# Altium schematic sheet Controller_driver.SchDoc: Controller Driver
size Tabloid; DrawnBy: Nicholas Belsten; Organization: MIT AeroAstro; DocumentNumber: 1; Revision: C; SheetNumber: 1; SheetTotal: 1; ProgramName: HelmHoltz Cage
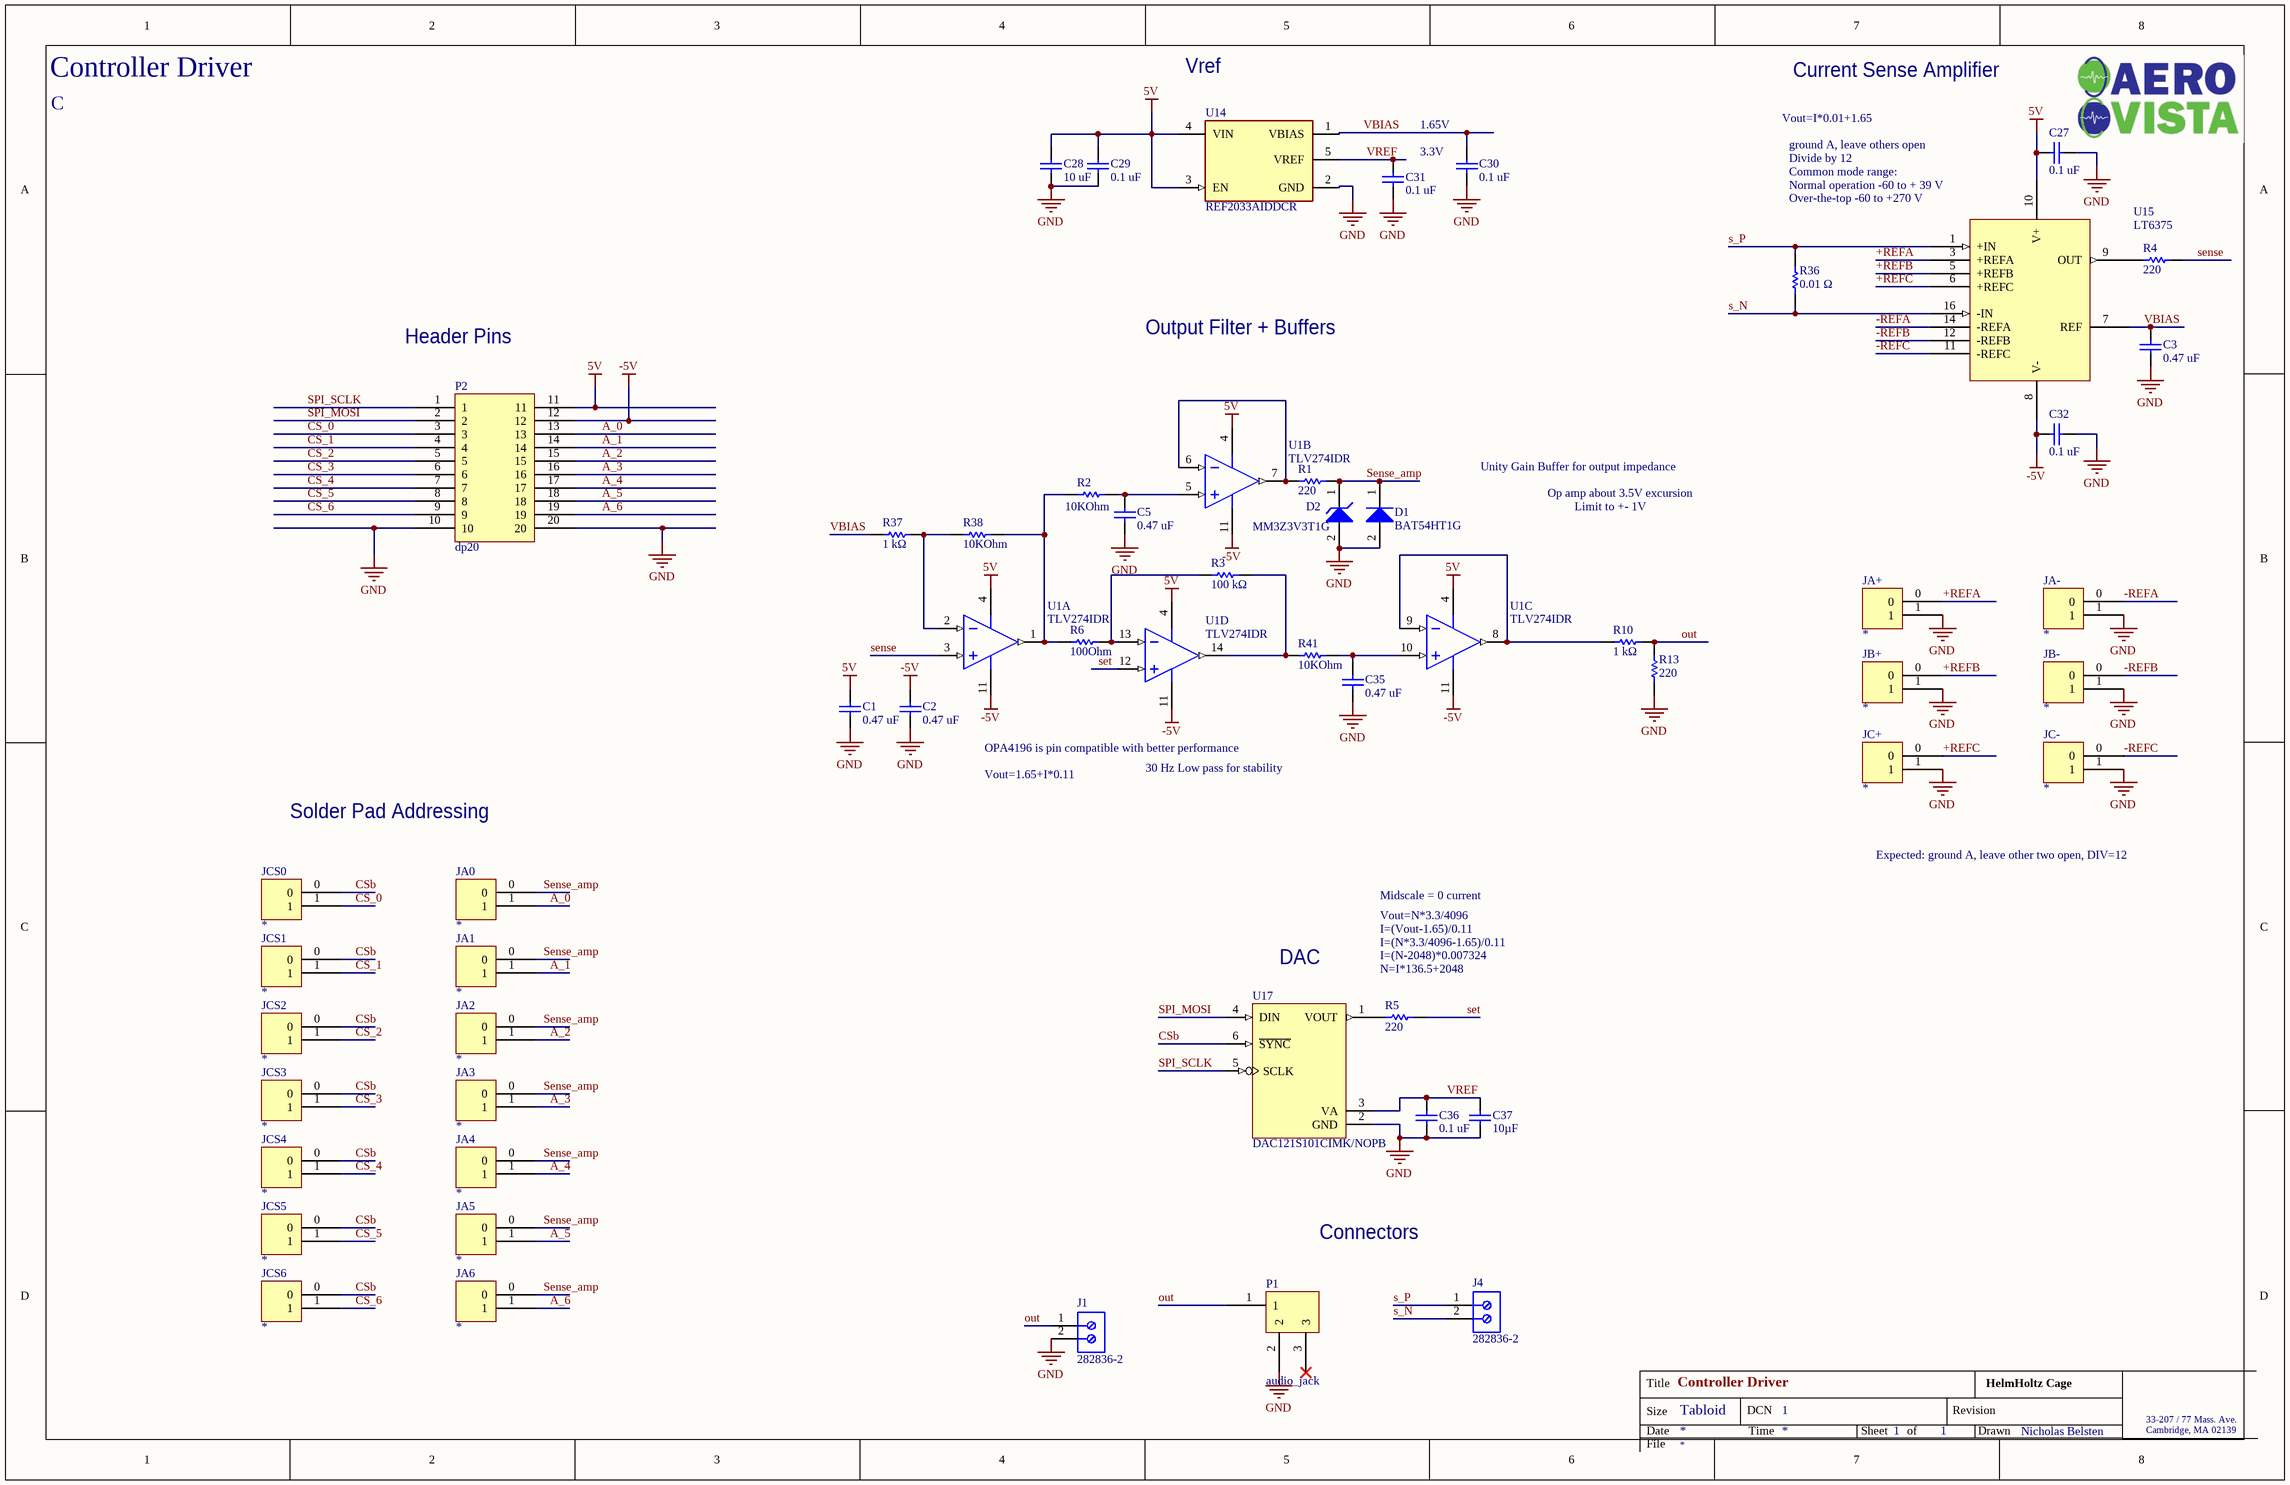
[diagram p0: Controller_driver.SchDoc]

## Parts
C1  0.47 uF  [CAPC1608X90X35ML10T15]
C2  0.47 uF  [CAPC1608X90X35ML10T15]
C3  0.47 uF  [CAPC1608X90X35ML10T15]
C5  0.47 uF  [CAPC1608X90X35ML10T15]
C27  0.1 uF  [CAPC1608X87X35NL15T15]
C28  10 uF  [CAPC1608X90X20ML10]
C29  0.1 uF  [CAPC1608X87X35NL15T15]
C30  0.1 uF  [CAPC1608X87X35NL15T15]
C31  0.1 uF  [CAPC1608X87X35NL15T15]
C32  0.1 uF  [CAPC1608X87X35NL15T15]
C35  0.47 uF  [CAPC1608X90X35ML10T15]
C36  0.1 uF  [CAPC1608X87X35NL15T15]
C37  10µF  [CAPC1608X90X20ML10]
D1  BAT54HT1G  [ONSC-SOD-323-2-477-02_V]
D2  MM3Z3V3T1G  [ONSC-SOD-323-2-477-02_V]
J1  282836-2  [TECO-282836-2_V]
J4  282836-2  [TECO-282836-2_V]
JA0  *  [solder_jumper]
JA1  *  [solder_jumper]
JA2  *  [solder_jumper]
JA3  *  [solder_jumper]
JA4  *  [solder_jumper]
JA5  *  [solder_jumper]
JA6  *  [solder_jumper]
JA+  *  [solder_jumper]
JA-  *  [solder_jumper]
JB+  *  [solder_jumper]
JB-  *  [solder_jumper]
JC+  *  [solder_jumper]
JC-  *  [solder_jumper]
JCS0  *  [solder_jumper]
JCS1  *  [solder_jumper]
JCS2  *  [solder_jumper]
JCS3  *  [solder_jumper]
JCS4  *  [solder_jumper]
JCS5  *  [solder_jumper]
JCS6  *  [solder_jumper]
P1  audio_jack  [MJ-3536NG]
P2  dp20  [dp20-900-double]
R1  220  [RESC1609X50X30LL10T20]
R2  10KOhm  [RESC1609X55X30LL15T15]
R3  100 kΩ  [RESC1608X55X25NL10T15]
R4  220  [RESC1609X50X30LL10T20]
R5  220  [RESC1609X50X30LL10T20]
R6  100Ohm  [RESC1608X55X25NL10T15]
R10  1 kΩ  [RESC1608X55X30LL20T20]
R13  220  [RESC1609X50X30LL10T20]
R36  0.01 Ω  [RESC3216X70X50LL05T20]
R37  1 kΩ  [RESC1608X55X30LL15T15]
R38  10KOhm  [RESC1609X55X30LL15T15]
R41  10KOhm  [RESC1609X55X30LL15T15]
U1  TLV274IDR  [D0014A_N]  (parts A,B,C,D of 4)
U14  REF2033AIDDCR  [FP-DDC0005A-MFG]
U15  LT6375  [SOP16-12]
U17  DAC121S101CIMK/NOPB  [MK06A_N]

## Nets
5V: C1.2 C27.2 C28.2 C29.2 P2.11 U1.4(VDD) U14.3(EN) U14.4(VIN) U15.10(V+)
-5V: C2.2 C32.2 P2.12 U1.11(GND) U15.8(V-)
GND: C1.1 C2.1 C3.1 C5.1 C27.1 C28.1 C29.1 C30.1 C31.1 C32.1 C35.1 C36.1 C37.1 D1.2(A) D2.2(A) J1.2 JA+.1 JA-.1 JB+.1 JB-.1 JC+.1 JC-.1 P1.2 P2.10 P2.20 R13.1 U14.2(GND) U17.2(GND)
+REFA: JA+.0 U15.3(+REFA)
+REFB: JB+.0 U15.5(+REFB)
+REFC: JC+.0 U15.6(+REFC)
-REFA: JA-.0 U15.14(-REFA)
-REFB: JB-.0 U15.12(-REFB)
-REFC: JC-.0 U15.11(-REFC)
A_0: JA0.1 P2.13
A_1: JA1.1 P2.14
A_2: JA2.1 P2.15
A_3: JA3.1 P2.16
A_4: JA4.1 P2.17
A_5: JA5.1 P2.18
A_6: JA6.1 P2.19
CS_0: JCS0.1 P2.3
CS_1: JCS1.1 P2.4
CS_2: JCS2.1 P2.5
CS_3: JCS3.1 P2.6
CS_4: JCS4.1 P2.7
CS_5: JCS5.1 P2.8
CS_6: JCS6.1 P2.9
CSb: JCS0.0 JCS1.0 JCS2.0 JCS3.0 JCS4.0 JCS5.0 JCS6.0 U17.6(~{SYNC})
out: J1.1 P1.1 R10.2 R13.2
s_N: J4.2 R36.1 U15.16(-IN)
s_P: J4.1 R36.2 U15.1(+IN)
sense: R4.2 U1.3(IN1+)
Sense_amp: D1.1(K) D2.1(K) JA0.0 JA1.0 JA2.0 JA3.0 JA4.0 JA5.0 JA6.0 R1.2
set: R5.2 U1.12(IN4+)
SPI_MOSI: P2.2 U17.4(DIN)
SPI_SCLK: P2.1 U17.5(SCLK)
VBIAS: C3.2 C30.2 R37.2 U14.1(VBIAS) U15.7(REF)
VREF: C31.2 C36.2 C37.2 U14.5(VREF) U17.3(VA)
NetC5_2: C5.2 R2.2 U1.5(IN2+)
NetC35_2: C35.2 R41.2 U1.10(IN3+)
NetR1_1: R1.1 U1.6(IN2-) U1.7(OUT2)
NetR2_1: R2.1 R6.1 R38.2 U1.1(OUT1)
NetR3_1: R3.1 R41.1 U1.14(OUT4)
NetR3_2: R3.2 R6.2 U1.13(IN4-)
NetR4_1: R4.1 U15.9(OUT)
NetR5_1: R5.1 U17.1(VOUT)
NetR10_1: R10.1 U1.8(OUT3) U1.9(IN3-)
NetR37_1: R37.1 R38.1 U1.2(IN1-)

Not connected (* = marked no-connect by the designer): P1 3*

## Notes on the sheet
- Vref
- Current Sense Amplifier
- 3.3V
- 1.65V
- Vout=I*0.01+1.65
- ground A, leave others open
- Divide by 12
- (near U15) Normal operation -60 to + 39 V
- (near U15) Over-the-top -60 to +270 V
- Common mode range:
- Header Pins
- Output Filter + Buffers
- Unity Gain Buffer for output impedance
- Op amp about 3.5V excursion
- Limit to +- 1V
- OPA4196 is pin compatible with better performance
- Solder Pad Addressing
- Vout=1.65+I*0.11
- 30 Hz Low pass for stability
- Midscale = 0 current
- Expected: ground A, leave other two open, DIV=12
- (near U17) DAC
- Vout=N*3.3/4096
- I=(Vout-1.65)/0.11
- I=(N*3.3/4096-1.65)/0.11
- I=(N-2048)*0.007324
- N=I*136.5+2048
- Connectors
- Title
- Size
- Date
- Tabloid
- DCN
- Time
- Sheet
- of
- Revision
- Drawn
- 33-207 / 77 Mass. Ave.
- Cambridge, MA 02139
- File

## Library data of the parts
C1-C3 C5 C35 = CMP-2006-02860-1: Manufacturer: Murata; Part Number: GRM188R71C474KA88D
C27 C29-C32 C36 = CMP-2006-03300-1: Part Number: C0603X104K5RACTU; Manufacturer: Kemet; Capacitance: 0.1 uF
C28 = CMP-2000-04979-1: Chip Capacitor, 10 uF, +/- 10%, 10 V, -55 to 85 degC, 0603 (1608 Metric), RoHS, Tape and Reel; PCN Part Number: MLCCPartNumberChange30/Nov/2012; Manufacturer: TDK; Temperature Coefficient: X5R; Product Training Modules: CSeriesGeneralApplicationsSEAT,CCV,andTVCLDesignToolsGuidetoReplacinganElectrolyticCapacitorwithanMLCC; Online Catalog: CSeries,GeneralPurpose; Voltage - Rated: 10V; Other Names: 445-7486-1; Capacitance: 10µF; Design Resources: 20WNon-IsolatedBuckLEDDriverUsingPLLNK460KG; Kits: 445-9003-KIT-ND-KITCAPCERHICAPMLCCSMD; Height - Seated (Max): -; Family: CeramicCapacitors; Package Description: 2-Pin Surface Mount Device, Body 1.6 x 0.8 mm; Category: Capacitors; Datasheet Version: Mar-15; RoHS Information: RoHSCertificate-MLCC; Thickness (Max): 0.035"(0.90mm); Operating Temperature: -55degC~85degC; Package Reference: 603; Series: C; Applications: GeneralPurpose; Datasheet URL: http://download.siliconexpert.com/pdfs/2015/4/21/15/54/45/779/tdk_/manual/37024850441143360mlcc_commercial_general_en.pdf; Features: -; Lead Style: -; Lead Spacing: -; Ratings: -; Size / Dimension: 0.063"Lx0.031"W(1.60mmx0.80mm); Tolerance: ±10%; Mounting Type: SurfaceMount,MLCC; Standard Package: 1; Package / Case: 0603(1608Metric); Manufacturer URL: http://www.tdk.com/; Packaging: CutTape(CT)
C37 = CMP-2000-04979-1: Chip Capacitor, 10 uF, +/- 10%, 10 V, -55 to 85 degC, 0603 (1608 Metric), RoHS, Tape and Reel; PCN Part Number: MLCCPartNumberChange30/Nov/2012; Manufacturer: TDK; Temperature Coefficient: X5R; Product Training Modules: CSeriesGeneralApplicationsSEAT,CCV,andTVCLDesignToolsGuidetoReplacinganElectrolyticCapacitorwithanMLCC; Online Catalog: CSeries,GeneralPurpose; Voltage - Rated: 10V; Other Names: 445-7486-1; Design Resources: 20WNon-IsolatedBuckLEDDriverUsingPLLNK460KG; Kits: 445-9003-KIT-ND-KITCAPCERHICAPMLCCSMD; Height - Seated (Max): -; Family: CeramicCapacitors; Package Description: 2-Pin Surface Mount Device, Body 1.6 x 0.8 mm; Category: Capacitors; Datasheet Version: Mar-15; RoHS Information: RoHSCertificate-MLCC; Thickness (Max): 0.035"(0.90mm); Operating Temperature: -55degC~85degC; Package Reference: 603; Series: C; Applications: GeneralPurpose; Datasheet URL: http://download.siliconexpert.com/pdfs/2015/4/21/15/54/45/779/tdk_/manual/37024850441143360mlcc_commercial_general_en.pdf; Capacitance: 10µF; Features: -; Lead Style: -; Lead Spacing: -; Ratings: -; Size / Dimension: 0.063"Lx0.031"W(1.60mmx0.80mm); Tolerance: ±10%; Mounting Type: SurfaceMount,MLCC; Standard Package: 1; Package / Case: 0603(1608Metric); Manufacturer URL: http://www.tdk.com/; Packaging: CutTape(CT)
D1 = CMP-1055-00462-1: Schottky Barrier Diode, 2-Pin SOD-323, Pb-Free, Tape and Reel; Manufacturer: On Semiconductor; Configuration: Single; trr Max (ns): 5; IFSM Max (A): 0.6; ComponentLink3URL: http://www.onsemi.com/pub_link/Collateral/477-02.PDF.1; PackageDescription: 2-Pin SOD, Body 1.7 x 1.25 mm; ComponentLink2URL: http://www.onsemi.cn/pub_link/Collateral/BAT54HT1-D.PDF; ComponentLink3Description: Package Specification; ComponentLink2Description: Datasheet; DatasheetVersion: Rev. 6; PackageReference: SOD-323-2-477-02; RoHS: TRUE; ComponentLink1URL: http://www.onsemi.com/; Packing: Tape and Reel; PartNumber: BAT54HT1G; Mounting Technology: Surface Mount; ComponentLink1Description: Manufacturer URL; PackageVersion: Rev. H, 03/2007
D2 = CMP-1060-00672-1: Zener Voltage Regulator, 300 mW, 2-Pin SOD-323, Pb-Free, Tape and Reel; Manufacturer: On Semiconductor; VZ Typ (V): 3.3; P Max (W): 0.3; ComponentLink1URL: http://www.onsemi.com/; ComponentLink2Description: Datasheet; PackageVersion: Rev. H, 03/2007; PartNumber: MM3Z3V3T1G; PackageReference: SOD-323-2-477-02; ComponentLink1Description: Manufacturer URL; PackageDescription: 2-Pin SOD, Body 1.7 x 1.25 mm; RoHS: Pb-Free; ComponentLink3Description: Package Specification; Packing: Tape and Reel; DatasheetVersion: Rev. 9; ComponentLink3URL: http://www.onsemi.com/pub_link/Collateral/477-02.PDF.1; Mounting Technology: Surface Mount; ComponentLink2URL: http://www.onsemi.cn/pub_link/Collateral/MM3Z2V4T1-D.PDF
J1 J4 = CMP-1684-00017-1: Female Header, Pitch 5 mm, 1 x 2 Position, Height 10 mm, Tail Length 3.5 mm, Rohs, Bulk; Manufacturer: TE Connectivity; Wire Gauge: 16-30AWG; Product Training Modules: Wire-to-BoardEurostyleTerminalBlocks; Clamp Material - Plating: Brass-NickelPlated; Voltage: 300V; Mating Orientation: HorizontalwithBoard; Current: 13.5A; Pitch: 0.197"(5.00mm); Screw Thread: M3; 3D Model: 282836-2.pdf; Other Names: 5ULV-02B / A98076; Dynamic Catalog: BuchananSeries; Number of Levels: 1; Torque - Screw: 0.68Nm(6Lb-In); Featured Product: EurostyleTerminalBlockConnectors; Positions Per Level: 2; Wire Termination: Screw-RisingCageClamp; Datasheet URL: http://www.te.com.cn/commerce/DocumentDelivery/DDEController?Action=showdoc&DocId=Catalog+Section%7F1308389_EUROSTYLE_TERMINAL_BLOCKS%7F0607%7Fpdf%7FEnglish%7FENG_CS_1308389_EUROSTYLE_TERMINAL_BLOCKS_0607.pdf%7F282836-2; Color: Green; Family: TerminalBlocks-WiretoBoard; RoHS Information: 282836-2StatementofCompliance; Standard Package: 300; Contact Material - Plating: Brass-TinPlated; Manufacturer URL: http://www.te.com; Housing Material: Polyamide(PA66),Nylon6/6; Features: Interlocking(Side); Package Description: Female Header, Pitch 5 mm, 1 x 2 Position, Height 10 mm, Tail Length 3.5 mm; Mounting Type: ThroughHole; Package Reference: THD; Packaging: Bulk; Series: Buchanan; Category: Connectors,Interconnects; Screw Material - Plating: Brass-NickelPlated
JA0-JA6 JA+ JA- JB+ JB- JC+ JC- JCS0-JCS6 = solder_jumper
P1 = audio_jack: pin to pad: 1>2 2>1
R1 R4 R5 R13 = CMP-2000-03085-1: Part Number: CRCW0603220RFKEA; Manufacturer: Vishay Dale; Resistance: 220
R2 R38 R41 = CMP-2000-07452-1: Chip Resistor, 10 KOhm, +/- 1%, 0.1 W, -55 to 155 degC, 0603 (1608 Metric), RoHS, Tape and Reel; Manufacturer: Panasonic; Voltage Rating: 75V; Case\/Package: 0603; Power Rating: 100mW; Temperature Coefficient: 100ppm\/degreesC; Number of Pins: 2; Package Reference: 603; Depth: 0.8mm; Mount: SurfaceMount; Package Description: 2-Pin Surface Mount Device, Body 1.6 x 0.85 mm; Datasheet Version: 02/2017; Resistance: 10KOhm; Length: 1.6mm; Lead Free: LeadFree; Height: 0.45mm; Number of Terminations: 2; Max Power Dissipation: 100mW; Min Operating Temperature: -55degC; Datasheet URL: https://industrial.panasonic.com/cdbs/www-data/pdf/RDA0000/AOA0000C304.pdf; Termination: SMD/SMT; Case Code (Metric): 1608; Case Code (Imperial): 0603; Tolerance: 1%; Max Operating Temperature: 155degC; RoHSCompliant: true; Voltage Rating (DC): 75V; Radiation Hardening: No; Packaging: TapeandReel; Composition: ThickFilm; Mounting Technology: SurfaceMount; Manufacturer URL: http://www.panasonic.com/; Width: 0.031inch; REACH SVHC: NoSVHC; Contact Plating: Tin; Military Standard: Not; Package Quantity: 1
R3 = CMP-2000-04301-1: Part Number: RC0603JR-10100KL; Manufacturer: Yageo; Resistance: 100 kΩ
R6 = CMP-2100-03663-1: Chip Resistor, 100 Ohm, +/- 1%, 0.1 W, -55 to 155 degC, 0603 (1608 Metric), RoHS, Tape and Reel; Manufacturer: Yageo; Voltage Rating (DC): 50V; Power Rating: 100mW; Temperature Coefficient: 100ppm/degreesC; Number of Pins: 2; Tolerance: 1%; Height: 0.45mm; Manufacturer URL: http://www.yageo.com/; Military Standard: Not; Datasheet URL: http://www.yageo.com/NewPortal/yageodocoutput?fileName=/pdf/R-Chip/PYu-RC_Group_51_RoHS_L_5.pdf; Case Code (Imperial): 0603; Termination: SMD/SMT; Lead Free: LeadFree; Max Operating Temperature: 155degC; Case Code (Metric): 1608; RoHSCompliant: true; Voltage Rating: 50V; Resistance: 100Ohm; Width: 0.8mm; Composition: ThickFilm; Depth: 0.8mm; REACH SVHC: Unknown; Min Operating Temperature: -55degC; Packaging: TapeandReel; Package Description: 2-Pin Surface Mount Device, Body 1.6 x 0.8 mm; Length: 1.6mm; Package Reference: 0603; Datasheet Version: Rev. 5, 10/2016; Case/Package: 0603
R10 = CMP-2000-00873-1: Manufacturer: Panasonic; Part Number: ERA3AEB102V; Resistance: 1 kΩ
R36 = CMP-2003-00764-1: Part Number: ERJ8BWFR010V; Manufacturer: Panasonic; Resistance: 0.01 Ω
R37 = CMP-2000-00180-1: Part Number: ERJ-3EKF1001V; Manufacturer: Panasonic; Resistance: 1 kΩ
U1 = CMP-0272-02760-3: 550 uA/Ch, 3 MHz, Rail-to-Rail Output Operational Amplifier, 2.7 to 16 V, -40 to 125 degC, 14-pin SOIC (D14), Green (RoHS & no Sb/Br); Manufacturer: Texas Instruments; CMRR(Min)(dB): 69; Offset Drift(Typ)(uV/C): 2; Total Supply Voltage(Min)(+5V is 5, +/-5V is 10): 2.7; Iq per channel(Max)(mA): 0.55; Number of Channels: 4; Sub Family: Low Supply Voltage Amplifier (<=2.7V), Precision Amplifier; Vio (25C)(Max)(mV): 5; Rating: Catalog; GBW(Typ)(MHz): 3; Slew Rate(Typ)(V/us): 2.4; IIB(Max)(pA): 60; Total Supply Voltage(Max)(+5V is 5, +/-5V is 10): 16; Packing: LARGE T&R; ComponentLink2Description: Datasheet; DatasheetVersion: SLOS351D; Code_JEDEC: MS-012; Mounting Technology: Surface Mount; ComponentLink1URL: http://www.ti.com/; PackageVersion: 4040047-5/M, 06/2011; ComponentLink3Description: Package Specification; PackageDescription: 14-Pin Plastic Small Outline, Body 8.65 x 3.9 mm, Pitch 1.27 mm; ComponentLink2URL: http://www.ti.com/lit/ds/symlink/tlv274.pdf; PartNumber: TLV274IDR; ComponentLink3URL: http://www.ti.com/lit/ml/mpds177g/mpds177g.pdf; PackageReference: D0014A; ComponentLink1Description: Manufacturer URL; Eco-Plan: Green (RoHS & no Sb/Br)
U14 = CMP-04916-000008-1: IC VREF SERIES 1.65V/3.3V 5SOT; Manufacturer: Texas Instruments; Standoff Height: 0mm; Nominal Supply Current: 360uA; Min Supply Voltage: 3.32V; Output Type: Fixed; Number Of Outputs: 2; Output Voltage: 1.65/3.3V; Output Current: 20mA; Max Supply Voltage: 5.5V; Max Junction Temp: +150°C; Automotive: No; Height: 1.1mm; Package: DDC0005A; Reference Type: Series; Manufacturer Part Number: REF2033AIDDCR; Temperature Range High: +125°C; Lead Free: Yes; ComponentLink2Description: Datasheet; Device Class L1: Integrated Circuits (ICs); Category: IC; RoHS: TRUE; Device Class L3: Voltage References; ComponentLink2URL: http://www.ti.com/lit/ds/symlink/ref2033.pdf; Device Class L2: Power Management ICs; Octopart: https://octopart.com/ref2033aiddcr-texas+instruments-46921199; Digikey Description: IC VREF SERIES 1.65V/3.3V 5SOT; Temperature: -40°C to +125°C; Temperature Range Low: -40°C
U17 = CMP-0061-00064-2: 12-Bit Micro Power, RRO Digital-to-Analog Converter, 6-pin Tiny SOT23, Pb-Free; Manufacturer: National Semiconductor; PackageTopMarking: X61C*XTT; CompType: D/A Converter; PowerWise: Y; PinCount: 6; ComponentLink1URL: http://www.national.com/ds/DA/DAC121S101.pdf; Code_JEDEC: MO-193-AA; Code_IPC: SOT26A-6; PackageReference: MK06A; ComponentLink2Description: DAC121S101 Web Page; PackageDescription: Molded TSOT, 2.97 x 1.65 x 0.87mm Body, 6 Lead, 0.95mm Pitch; ComponentLink3Description: MK06A Package Page; ComponentLink1Description: DAC121S101 Datasheet; RoHS: Y; ComponentLink3URL: http://www.national.com/packaging/folders/mk06a.html; PackageVersion: revE, Nov-2008; RevisionNote: Component URLs added; DatasheetVersion: Feb-2010; ComponentLink2URL: http://www.national.com/pf/DA/DAC121S101.html